# Altium schematic sheet boosterdeel2.SchDoc
size A4; SheetNumber: 1; SheetTotal: 2
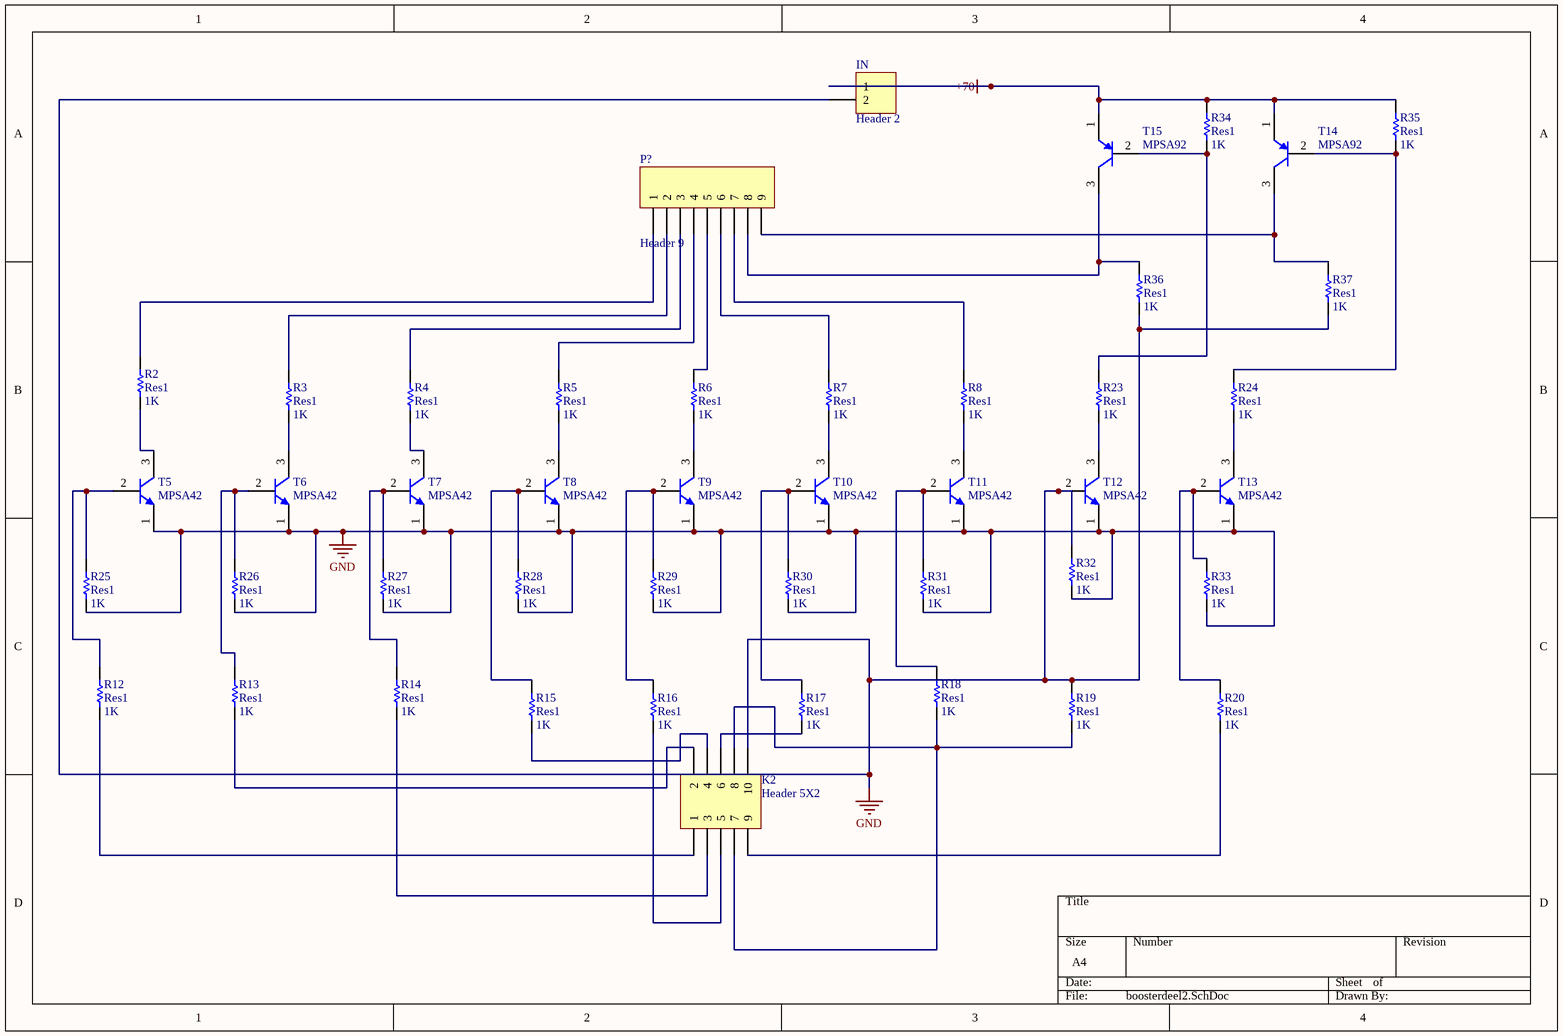
[diagram p0: boosterdeel2.SchDoc]

## Parts
IN  Header 2  [HDR1X2]
K2  Header 5X2  [HDR2X5]
P?  Header 9  [HDR1X9]
R2  Res1  value 1K  [C1206]
R3  Res1  value 1K  [C1206]
R4  Res1  value 1K  [C1206]
R5  Res1  value 1K  [C1206]
R6  Res1  value 1K  [C1206]
R7  Res1  value 1K  [C1206]
R8  Res1  value 1K  [C1206]
R12  Res1  value 1K  [C1206]
R13  Res1  value 1K  [C1206]
R14  Res1  value 1K  [C1206]
R15  Res1  value 1K  [C1206]
R16  Res1  value 1K  [C1206]
R17  Res1  value 1K  [C1206]
R18  Res1  value 1K  [C1206]
R19  Res1  value 1K  [C1206]
R20  Res1  value 1K  [C1206]
R23  Res1  value 1K  [C2512]
R24  Res1  value 1K  [C2512]
R25  Res1  value 1K  [C2512]
R26  Res1  value 1K  [C2512]
R27  Res1  value 1K  [C2512]
R28  Res1  value 1K  [C2512]
R29  Res1  value 1K  [C2512]
R30  Res1  value 1K  [C2512]
R31  Res1  value 1K  [C2512]
R32  Res1  value 1K  [C2512]
R33  Res1  value 1K  [C2512]
R34  Res1  value 1K  [C2512]
R35  Res1  value 1K  [C2512]
R36  Res1  value 1K  [C2512]
R37  Res1  value 1K  [C2512]
T5  MPSA42  [ONSC-TO-92-3-29-11]
T6  MPSA42  [ONSC-TO-92-3-29-11]
T7  MPSA42  [ONSC-TO-92-3-29-11]
T8  MPSA42  [ONSC-TO-92-3-29-11]
T9  MPSA42  [ONSC-TO-92-3-29-11]
T10  MPSA42  [ONSC-TO-92-3-29-11]
T11  MPSA42  [ONSC-TO-92-3-29-11]
T12  MPSA42  [ONSC-TO-92-3-29-11]
T13  MPSA42  [ONSC-TO-92-3-29-11]
T14  MPSA92  [ONSC-TO-92-3-29-11]
T15  MPSA92  [ONSC-TO-92-3-29-11]

## Nets
+70: IN.1 R34.2 R35.2 T14.1(E) T15.1(E)
GND: IN.2 K2.10 R19.2 R25.1 R26.1 R27.1 R28.1 R29.1 R30.1 R31.1 R32.1 R32.2 R33.1 R36.1 R37.1 T5.1(E) T6.1(E) T7.1(E) T8.1(E) T9.1(E) T10.1(E) T11.1(E) T12.1(E) T12.2(B) T13.1(E)
NetK2_1: K2.1 R12.1
NetK2_2: K2.2 R13.1
NetK2_3: K2.3 R14.1
NetK2_4: K2.4 R15.1
NetK2_5: K2.5 R16.1
NetK2_6: K2.6 R17.1
NetK2_7: K2.7 K2.8 R18.1 R19.1
NetK2_9: K2.9 R20.1
NetP?_1: P?.1 R2.2
NetP?_2: P?.2 R3.2
NetP?_3: P?.3 R4.2
NetP?_4: P?.4 R5.2
NetP?_5: P?.5 R6.2
NetP?_6: P?.6 R7.2
NetP?_7: P?.7 R8.2
NetP?_8: P?.8 R36.2 T15.3(C)
NetP?_9: P?.9 R37.2 T14.3(C)
NetR2_1: R2.1 T5.3(C)
NetR3_1: R3.1 T6.3(C)
NetR4_1: R4.1 T7.3(C)
NetR5_1: R5.1 T8.3(C)
NetR6_1: R6.1 T9.3(C)
NetR7_1: R7.1 T10.3(C)
NetR8_1: R8.1 T11.3(C)
NetR12_2: R12.2 R25.2 T5.2(B)
NetR13_2: R13.2 R26.2 T6.2(B)
NetR14_2: R14.2 R27.2 T7.2(B)
NetR15_2: R15.2 R28.2 T8.2(B)
NetR16_2: R16.2 R29.2 T9.2(B)
NetR17_2: R17.2 R30.2 T10.2(B)
NetR18_2: R18.2 R31.2 T11.2(B)
NetR20_2: R20.2 R33.2 T13.2(B)
NetR23_1: R23.1 T12.3(C)
NetR23_2: R23.2 R34.1 T15.2(B)
NetR24_1: R24.1 T13.3(C)
NetR24_2: R24.2 R35.1 T14.2(B)

## Library data of the parts
IN = Header 2: Header, 2-Pin; LatestRevisionDate: 17-Jul-2002; LatestRevisionNote: Re-released for DXP Platform.; Publisher: Altium Limited
K2 = Header 5X2: Header, 5-Pin, Dual row; LatestRevisionDate: 17-Jul-2002; LatestRevisionNote: Re-released for DXP Platform.; Publisher: Altium Limited
P? = Header 9: Header, 9-Pin; LatestRevisionDate: 17-Jul-2002; LatestRevisionNote: Re-released for DXP Platform.; Publisher: Altium Limited
R2-R8 R12-R20 R23-R37 = Res1: Resistor; Published: 8-Jun-2000; LatestRevisionDate: 17-Jul-2002; LatestRevisionNote: Re-released for DXP Platform.; PackageReference: AXIAL-0.3; Publisher: Altium Limited; PackageDescription: Axial Device, Thru-Hole; 2 Leads; 0.3 in Pin Spacing
T5-T13 = CMP-1048-01390-1: High Voltage Transistor, NPN Silicon, 3-Pin TO-92, Bulk Box; Manufacturer: On Semiconductor; fT Min (MHz): 50; Note1: 0; IC Continuous (A): 0.5; ComponentLink3Description: Package Specification; PackageReference: TO-92-3-29-11_AM_SL; Packing: Bulk Box; ComponentLink1URL: http://www.onsemi.com/; PackageDescription: 3-Pin Transistor Outline, Body 4.825 x 3.685 mm, Pitch 1.27 mm; Mounting Technology: Through Hole; RoHS: FALSE; DatasheetVersion: Rev. 8; PackageVersion: Rev. AM; ComponentLink2Description: Datasheet; ComponentLink1Description: Manufacturer URL; ComponentLink2URL: http://www.onsemi.cn/pub_link/Collateral/MPSA42-D.PDF; ComponentLink3URL: http://www.onsemi.cn/pub_link/Collateral/2N6426-D.PDF; Polarity: NPN; PartNumber: MPSA42
T14 T15 = CMP-1048-01411-1: High Voltage Transistor, PNP Silicon, 3-Pin TO-92, Bulk Box; Manufacturer: On Semiconductor; fT Min (MHz): 50; IC Continuous (A): -0.5; ComponentLink2Description: Datasheet; DatasheetVersion: Rev. 6; Polarity: PNP; ComponentLink2URL: http://www.onsemi.cn/pub_link/Collateral/MPSA92-D.PDF; PackageVersion: Rev. AM; ComponentLink1URL: http://www.onsemi.com/; Packing: Bulk Box; RoHS: FALSE; PackageDescription: 3-Pin Transistor Outline, Body 4.825 x 3.685 mm, Pitch 1.27 mm; ComponentLink3Description: Package Specification; PackageReference: TO-92-3-29-11_AM_SL; ComponentLink3URL: http://www.onsemi.cn/pub_link/Collateral/2N6426-D.PDF; ComponentLink1Description: Manufacturer URL; Mounting Technology: Through Hole; PartNumber: MPSA92